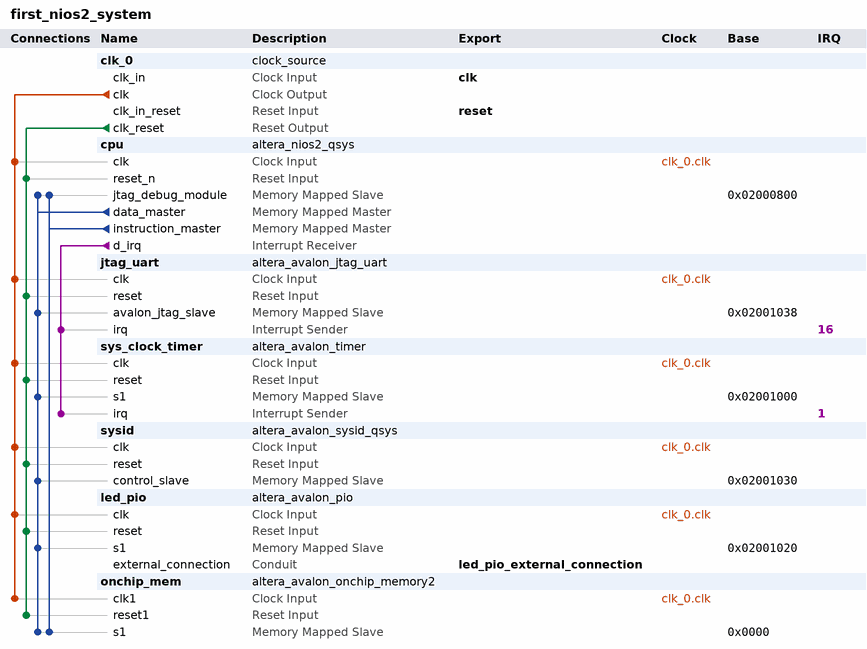
[diagram p0: system contents]
# Platform Designer (Qsys) system first_nios2_system, Cyclone V 5CSEMA5F31C6
# Parameters at their usual value, and those the tool derives, are not listed.
package require -exact qsys 16.0
create_system first_nios2_system
set_project_property DEVICE_FAMILY {Cyclone V}
set_project_property DEVICE 5CSEMA5F31C6

add_instance clk_0 clock_source 16.0
set_instance_parameter_value clk_0 clockFrequency 50000000

add_instance cpu altera_nios2_qsys 16.0
set_instance_parameter_value cpu breakSlave cpu.jtag_debug_module
set_instance_parameter_value cpu exceptionSlave onchip_mem.s1
set_instance_parameter_value cpu icache_size 2048
set_instance_parameter_value cpu impl Small
set_instance_parameter_value cpu mmu_TLBMissExcSlave None
set_instance_parameter_value cpu muldiv_multiplierType NoneSmall
set_instance_parameter_value cpu resetSlave onchip_mem.s1
set_instance_parameter_value cpu resetrequest_enabled true

add_instance jtag_uart altera_avalon_jtag_uart 16.0
set_instance_parameter_value jtag_uart simInteractiveOptions NO_INTERACTIVE_WINDOWS

add_instance sys_clock_timer altera_avalon_timer 16.0
set_instance_parameter_value sys_clock_timer period 1
set_instance_parameter_value sys_clock_timer periodUnits MSEC

add_instance sysid altera_avalon_sysid_qsys 16.0
set_instance_parameter_value sysid id 0

add_instance led_pio altera_avalon_pio 16.0
set_instance_parameter_value led_pio direction Output
set_instance_parameter_value led_pio width 8

add_instance onchip_mem altera_avalon_onchip_memory2 16.0
set_instance_parameter_value onchip_mem dataWidth 32
set_instance_parameter_value onchip_mem dualPort false
set_instance_parameter_value onchip_mem initMemContent true
set_instance_parameter_value onchip_mem initializationFileName onchip_mem.hex
set_instance_parameter_value onchip_mem memorySize 2480

# connections
add_connection clk_0.clk cpu.clk clock
add_connection clk_0.clk jtag_uart.clk clock
add_connection clk_0.clk led_pio.clk clock
add_connection clk_0.clk onchip_mem.clk1 clock
add_connection clk_0.clk sys_clock_timer.clk clock
add_connection clk_0.clk sysid.clk clock
add_connection clk_0.clk_reset cpu.reset_n reset
add_connection clk_0.clk_reset jtag_uart.reset reset
add_connection clk_0.clk_reset led_pio.reset reset
add_connection clk_0.clk_reset onchip_mem.reset1 reset
add_connection clk_0.clk_reset sys_clock_timer.reset reset
add_connection clk_0.clk_reset sysid.reset reset
add_connection cpu.data_master cpu.jtag_debug_module avalon
set_connection_parameter_value cpu.data_master/cpu.jtag_debug_module baseAddress 0x02000800
add_connection cpu.data_master jtag_uart.avalon_jtag_slave avalon
set_connection_parameter_value cpu.data_master/jtag_uart.avalon_jtag_slave baseAddress 0x02001038
add_connection cpu.data_master led_pio.s1 avalon
set_connection_parameter_value cpu.data_master/led_pio.s1 baseAddress 0x02001020
add_connection cpu.data_master onchip_mem.s1 avalon
set_connection_parameter_value cpu.data_master/onchip_mem.s1 baseAddress 0x0000
add_connection cpu.data_master sys_clock_timer.s1 avalon
set_connection_parameter_value cpu.data_master/sys_clock_timer.s1 baseAddress 0x02001000
add_connection cpu.data_master sysid.control_slave avalon
set_connection_parameter_value cpu.data_master/sysid.control_slave baseAddress 0x02001030
add_connection cpu.instruction_master cpu.jtag_debug_module avalon
set_connection_parameter_value cpu.instruction_master/cpu.jtag_debug_module baseAddress 0x02000800
add_connection cpu.instruction_master onchip_mem.s1 avalon
set_connection_parameter_value cpu.instruction_master/onchip_mem.s1 baseAddress 0x0000
add_connection cpu.d_irq jtag_uart.irq interrupt
set_connection_parameter_value cpu.d_irq/jtag_uart.irq irqNumber 16
add_connection cpu.d_irq sys_clock_timer.irq interrupt
set_connection_parameter_value cpu.d_irq/sys_clock_timer.irq irqNumber 1

# exported interfaces
add_interface clk clock sink
set_interface_property clk EXPORT_OF clk_0.clk_in
add_interface led_pio_external_connection conduit end
set_interface_property led_pio_external_connection EXPORT_OF led_pio.external_connection
add_interface reset reset sink
set_interface_property reset EXPORT_OF clk_0.clk_in_reset

set_interconnect_requirement {$system} qsys_mm.clockCrossingAdapter HANDSHAKE
set_interconnect_requirement {$system} qsys_mm.enableEccProtection FALSE
set_interconnect_requirement {$system} qsys_mm.insertDefaultSlave FALSE
set_interconnect_requirement {$system} qsys_mm.maxAdditionalLatency 1

save_system first_nios2_system.qsys
